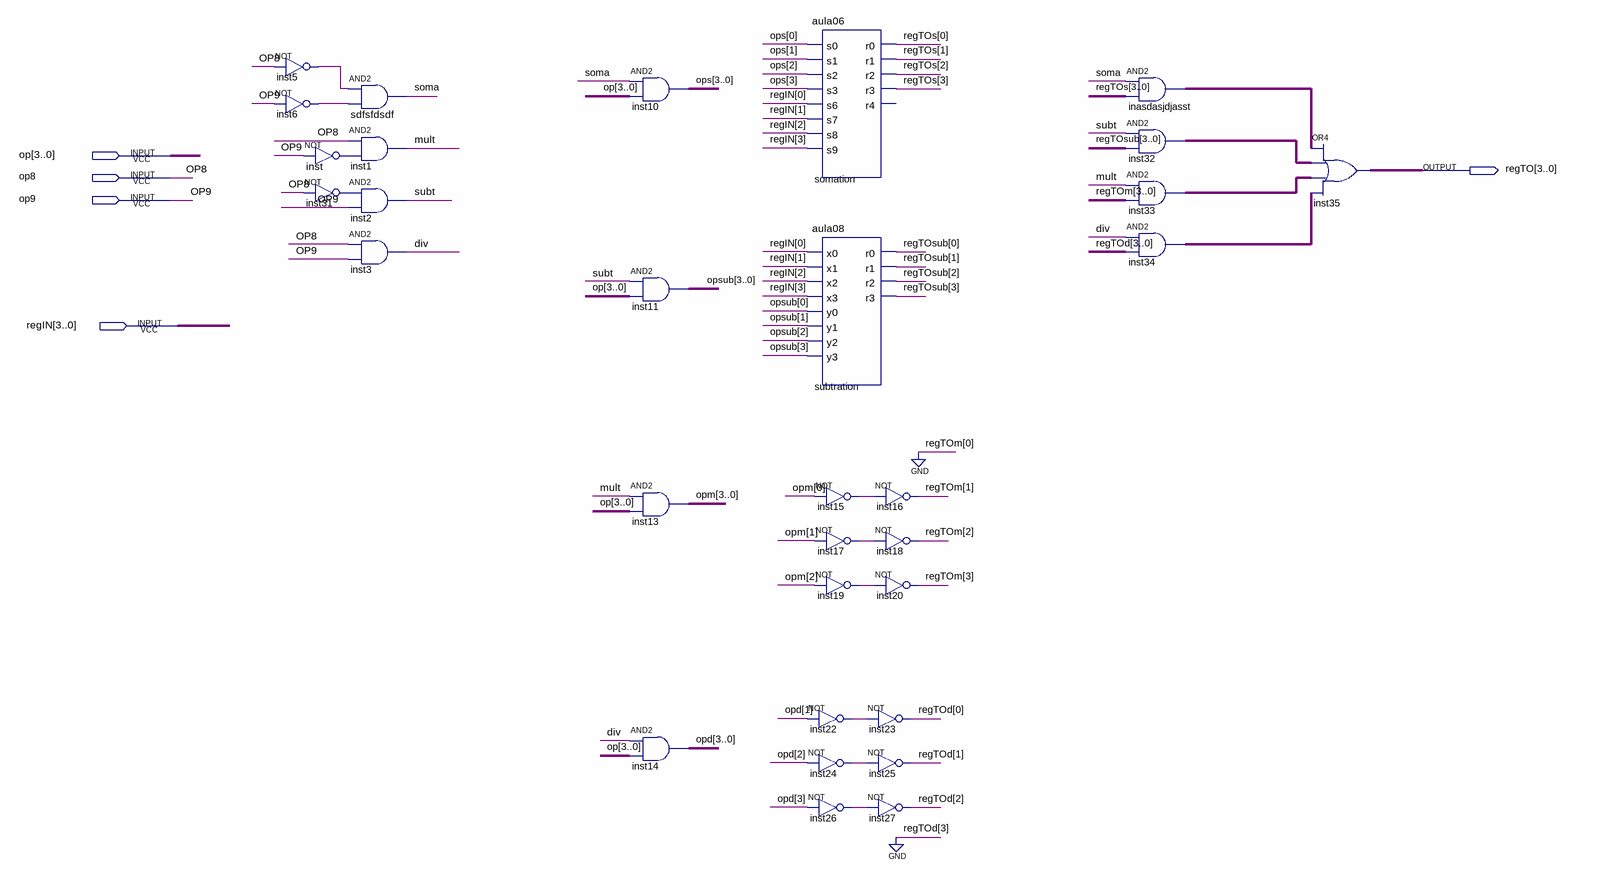
[diagram p0: schematic sheet]
// Quartus schematic ula.bdf as structural Verilog: 31 symbols, 5 pins
module ula (
  input  [3:0] op,
  input  op8,
  input  op9,
  input  [3:0] regIN,
  output [3:0] regTO
);

  wire div, inst5_out, inst6_out, inst15_out, inst17_out, inst19_out, inst22_out, inst24_out, inst26_out,
       inst31_out, inst_out, mult, soma, subt;
  wire [2:0] regTOd;
  wire [3:0] inasdasjdjasst_out, inst32_out, inst33_out, inst34_out, opd, opm, ops, opsub, regTOs, regTOsub;
  wire [3:1] regTOm;

  not inst5 (inst5_out, op8);
  not inst6 (inst6_out, op9);
  not inst (inst_out, op9);
  not inst31 (inst31_out, op8);
  and sdfsfdsdf (soma, inst5_out, inst6_out);
  and inst1 (mult, op8, inst_out);
  and inst2 (subt, inst31_out, op9);
  and inst3 (div, op8, op9);
  assign ops = {4{soma}} & op;  // AND2 inst10, 4 bits wide
  assign opsub = {4{subt}} & op;  // AND2 inst11, 4 bits wide
  assign opm = {4{mult}} & op;  // AND2 inst13, 4 bits wide
  assign opd = {4{div}} & op;  // AND2 inst14, 4 bits wide
  aula06 somation (
    .s0(ops[0]), .s1(ops[1]), .s2(ops[2]), .s3(ops[3]), .s6(regIN[0]), .s7(regIN[1]), .s8(regIN[2]),
    .s9(regIN[3]), .r0(regTOs[0]), .r1(regTOs[1]), .r2(regTOs[2]), .r3(regTOs[3]));  // open: r4
  aula08 subtration (
    .x0(regIN[0]), .x1(regIN[1]), .x2(regIN[2]), .x3(regIN[3]), .y0(opsub[0]), .y1(opsub[1]), .y2(opsub[2]),
    .y3(opsub[3]), .r0(regTOsub[0]), .r1(regTOsub[1]), .r2(regTOsub[2]), .r3(regTOsub[3]));
  not inst15 (inst15_out, opm[0]);
  not inst17 (inst17_out, opm[1]);
  not inst19 (inst19_out, opm[2]);
  not inst22 (inst22_out, opd[1]);
  not inst24 (inst24_out, opd[2]);
  not inst26 (inst26_out, opd[3]);
  not inst16 (regTOm[1], inst15_out);
  not inst18 (regTOm[2], inst17_out);
  not inst20 (regTOm[3], inst19_out);
  not inst23 (regTOd[0], inst22_out);
  not inst25 (regTOd[1], inst24_out);
  not inst27 (regTOd[2], inst26_out);
  assign inasdasjdjasst_out = {4{soma}} & regTOs;  // AND2 inasdasjdjasst, 4 bits wide
  assign inst32_out = {4{subt}} & regTOsub;  // AND2 inst32, 4 bits wide
  assign inst33_out = {4{mult}} & {regTOm, 1'b0};  // AND2 inst33, 4 bits wide
  assign inst34_out = {4{div}} & {1'b0, regTOd};  // AND2 inst34, 4 bits wide
  assign regTO = inasdasjdjasst_out | inst32_out | inst33_out | inst34_out;  // OR4 inst35, 4 bits wide
endmodule
